# Altium schematic sheet mram.SchDoc
size A3; DocumentNumber: 34; SheetNumber: 34; SheetTotal: 45; SheetDescription: Magnetoresistive RAM (MRAM)
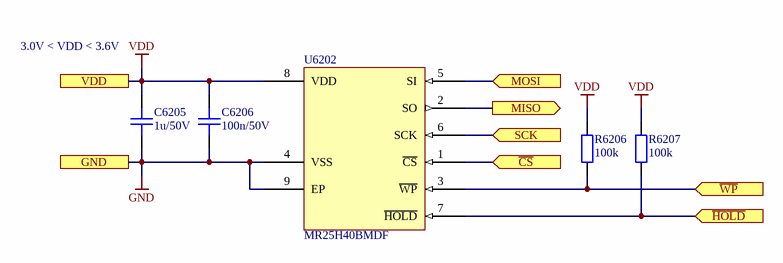
[diagram p0: mram.SchDoc]

## Parts
C6205  1u/50V  [CAPC1608X08N]
C6206  100n/50V  [CAPC1005X06N]
R6206  100k  [RESC1005X04N]
R6207  100k  [RESC1005X04N]
U6202  MR25H40BMDF  [MR25H40]

## Ports
GND, MISO (out), MOSI (in), SCK (in), VDD, ~{CS} (in), ~{HOLD} (in), ~{WP} (in)

## Nets
GND: C6205.1 C6206.1 U6202.4(VSS) U6202.9(EP) ; port GND
VDD: C6205.2 C6206.2 R6206.2 R6207.2 U6202.8(VDD) ; port VDD
~{CS}: U6202.1(~{CS}) ; port ~{CS}
~{HOLD}: R6207.1 U6202.7(~{HOLD}) ; port ~{HOLD}
~{WP}: R6206.1 U6202.3(~{WP}) ; port ~{WP}
MISO: U6202.2(SO) ; port MISO
MOSI: U6202.5(SI) ; port MOSI
SCK: U6202.6(SCK) ; port SCK

## Notes on the sheet
- 3.0V < VDD < 3.6V
- Fraunhofer IISB
- Schottkystr. 10
- developed by:
- 91058 Erlangen
- Germany
- Author
- Project
- License
- Description
- File
- Version
- Release Date
- Sheet
- foxbms.org <https://foxbms.org>
- www.iisb.fraunhofer.de <https://www.iisb.fraunhofer.de/>
- foxBMS Team
- /

## Library data of the parts
C6205 = gen_C_ceramic_1u_50V_X7R_0603: MLCC; Capacitance: 1u; Rated Voltage: 50V; Dielectric: X7R; Case EIA: 0603; Case Metric: 1608; Automotive Qualified: False; Tolerance: ± 10%; PnP Package: 0603C; Part Number: gen_C_ceramic_1u_50V_X7R_0603; Operating Temperature: -55°C - +125°C; Supplier 1: Farnell; Supplier Part Number 1: 2779055
C6206 = gen_C_ceramic_100n_50V_X7R_0402: MLCC; Capacitance: 100n; Rated Voltage: 50V; Dielectric: X7R; Case EIA: 0402; Case Metric: 1005; PnP Package: 0402C; PnP Value: 100nF/50V/X7R; PnP equipped: x; Automotive Qualified: True; AEC-Q Norm: AEC-Q200; Part Number: gen_C_ceramic_100n_50V_X7R_0402; Supplier 1: Farnell; Supplier Part Number 1: 2210822; ECCN: EAR99
R6206 R6207 = gen_R_100k_0402: SMD Resistor 100k 0402; Tolerance: 1%; Power: 0.063W; Case EIA: 0402; Case Metric: 1005; Maximum Working Voltage: 50V; PnP Package: 0402R; PnP equipped: x; Automotive Qualified: True; Part Number: gen_R_100k_0402; Operating Temperature: -55°C - +155°C; Resistance: 100k; Series: E24, E96; PnP Value: 100k; Supplier 1: Farnell; Supplier Part Number 1: 2302839
U6202 = MR25H40BMDF: Magnetoresistive random access memory (MRAM) device; Manufacturer: Everspin; PnP Package: DFN-8; Automotive Qualified: False; Part Number: MR25H40BMDF; Part Name: MR25H40BMDF; Operating Temperature: −40°C - +125°C